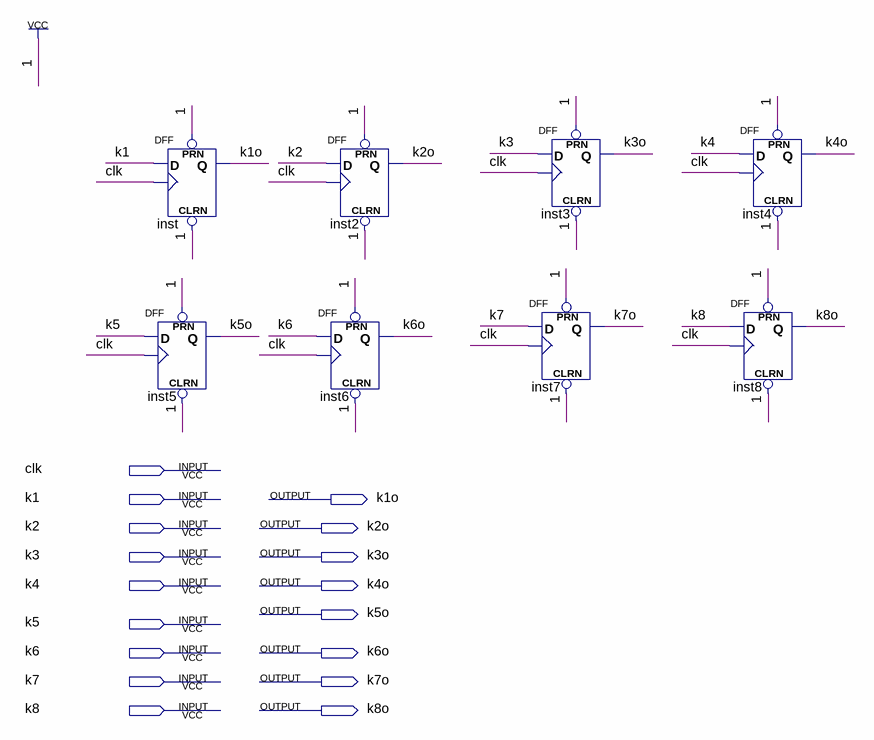
[diagram p0: schematic sheet]
// Quartus schematic XIAOCHAN.bdf as structural Verilog: 8 symbols, 17 pins
module XIAOCHAN (
  input  clk,
  input  k1,
  input  k2,
  input  k3,
  input  k4,
  input  k5,
  input  k6,
  input  k7,
  input  k8,
  output k1o,
  output k2o,
  output k3o,
  output k4o,
  output k5o,
  output k6o,
  output k7o,
  output k8o
);

  DFF inst (.CLRN(1'b1), .CLK(clk), .D(k1), .PRN(1'b1), .Q(k1o));
  DFF inst5 (.CLRN(1'b1), .CLK(clk), .D(k5), .PRN(1'b1), .Q(k5o));
  DFF inst2 (.CLRN(1'b1), .CLK(clk), .D(k2), .PRN(1'b1), .Q(k2o));
  DFF inst6 (.CLRN(1'b1), .CLK(clk), .D(k6), .PRN(1'b1), .Q(k6o));
  DFF inst3 (.CLRN(1'b1), .CLK(clk), .D(k3), .PRN(1'b1), .Q(k3o));
  DFF inst7 (.CLRN(1'b1), .CLK(clk), .D(k7), .PRN(1'b1), .Q(k7o));
  DFF inst4 (.CLRN(1'b1), .CLK(clk), .D(k4), .PRN(1'b1), .Q(k4o));
  DFF inst8 (.CLRN(1'b1), .CLK(clk), .D(k8), .PRN(1'b1), .Q(k8o));
endmodule
